# EAGLE board SDA391V1_TASLAK (EAGLE 9.6.2), part 1 of 2
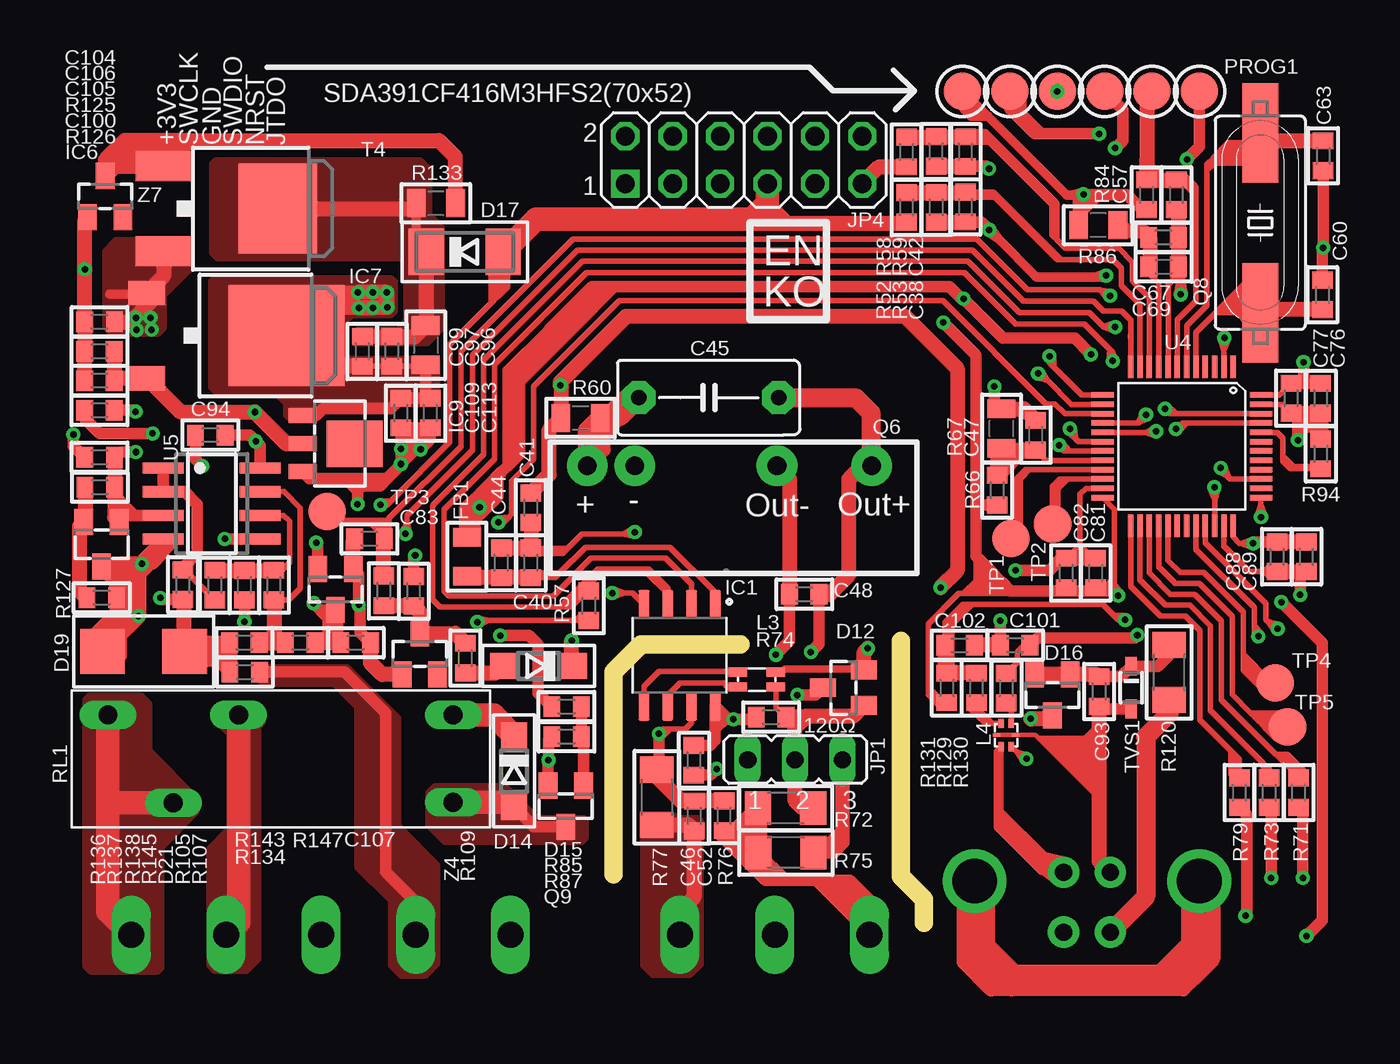
[diagram p5: board, top side]
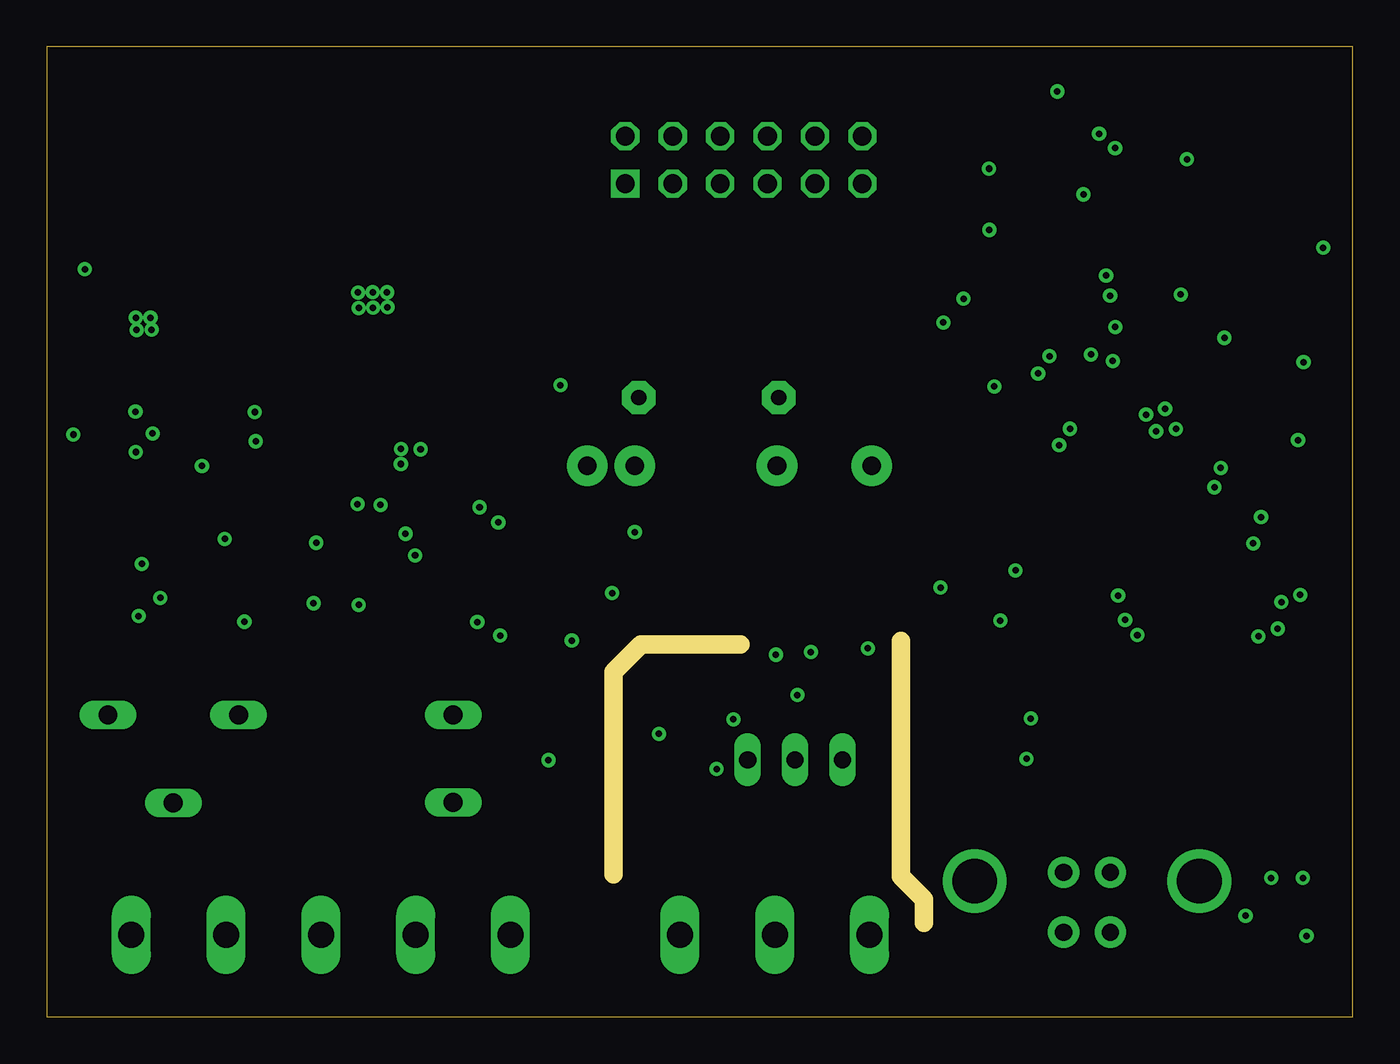
[diagram p6: board, inner layer Route3]
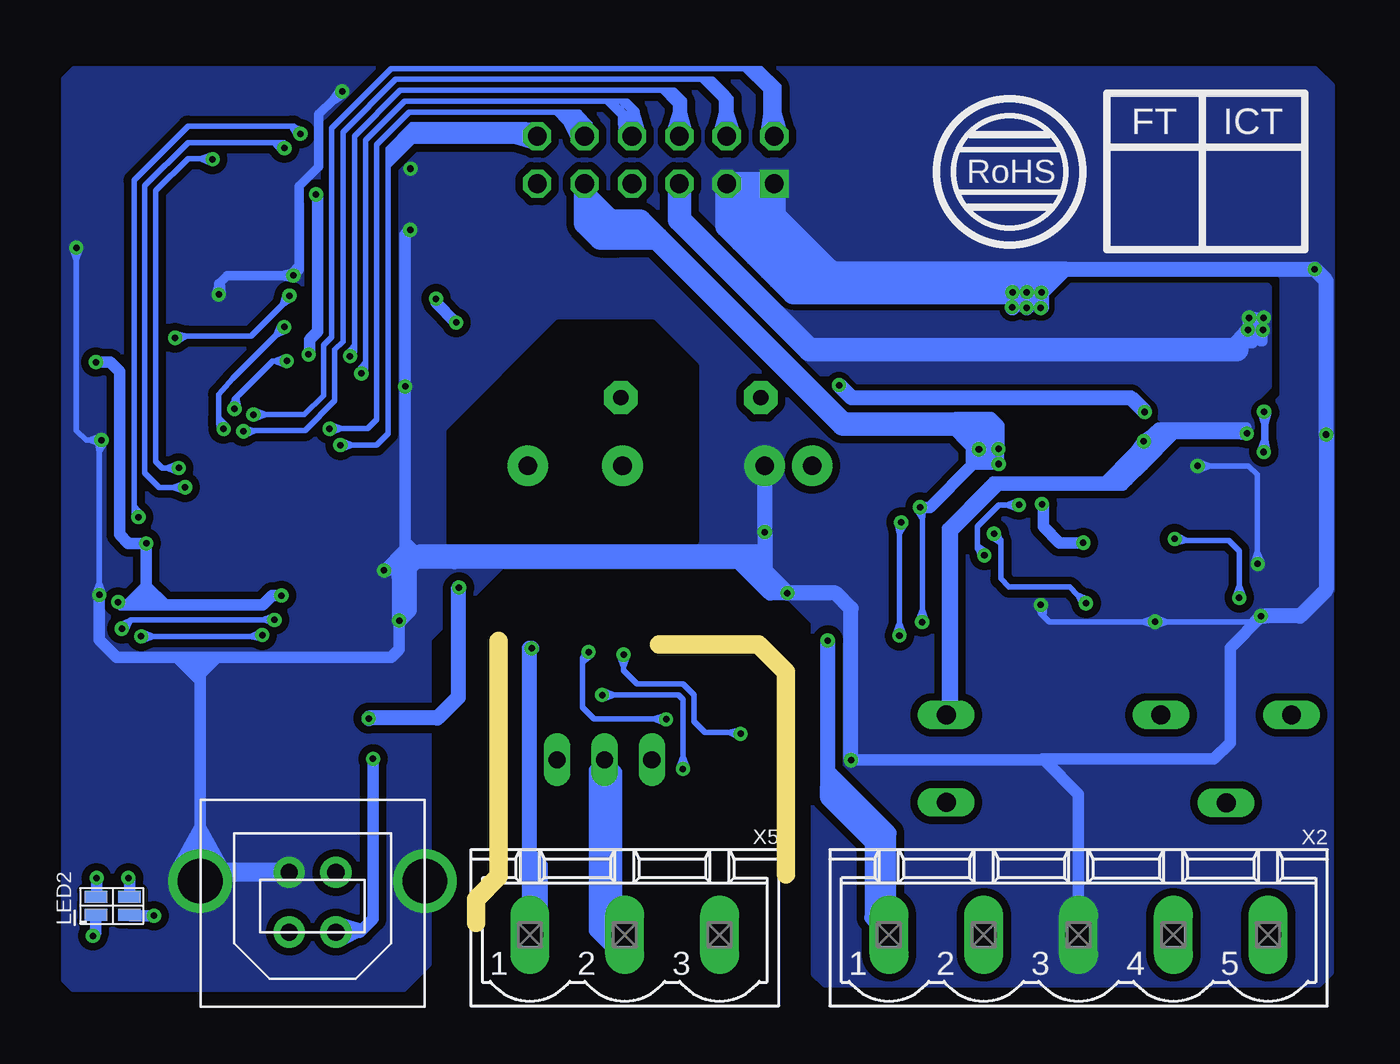
[diagram p7: board, bottom side, seen from below]

No outline drawn. Coordinates in mm, seen from the top.
Copper layers (1*3*16): Top 0.035mm / dielectric 1.53mm / Route3 0mil / dielectric 0mil / Bottom 0.035mm
Design rules "default *": minimum track width 6mil, minimum drill 0.35mm, track to track 11mil, track to pad 11mil, pad to pad 11mil, via to via 11mil, smd to smd 11mil, copper to edge 40mil, drill to drill 6mil, minimum pad ring 10mil, minimum via ring 8mil, stop-mask expansion 4mil, vias tented up to drill 0mil, thermal gap 10mil
Milling: 6 lines

## Footprints (pad centres in the part's own frame; a part is rotated, then mirrored left to right if it is on the bottom)
C0603_ENKO = smd 0.9 x 1.1: 1 -0.794,0; 2 0.794,0
C050-055X075_SMALL = drill 0.813 pad 1.778 octagon: 1 -3.75,0; 2 3.75,0
C0805_ENKO = smd 1 x 1.5: 1 -1.052,0; 2 1.052,0
SOT23 = smd 1 x 1.4: 1 -0.95,-1.1; 2 0.95,-1.1; 3 0,1.1
SOD123 = smd 1.4 x 1.4: A 1.9,0; C -1.9,0
M7_DC_DIYOT = smd 1.9 x 2.5: A -2.05,0; C 2.05,0
TRANSIL_SMB = smd 2.4 x 2.4: A 2.2,0; A1 -2.2,0
FERRITE_BEAT_0805 = smd 1 x 1.5: 1 -1.052,0; 2 1.052,0
ISO1044 = smd 1.55 x 0.59: 1 -2.725,1.905; 2 -2.725,0.635; 3 -2.725,-0.635; 4 -2.725,-1.905; 5 2.725,-1.905; 6 2.725,-0.635; 7 2.725,0.635; 8 2.725,1.905
TL431_SOT23F = smd 1 x 1.4: A 0,1.2; C -0.95,-1.2; R 0.95,-1.2
TO252 = smd 1.3 x 2: 1 -2.28,-5; 2 2.28,-5 | smd 5.4 x 6.2: 3 0,2.5
SOT89 = smd 0.8 x 1.5: 1 -1.5,-1.75; 2 0,-1.75; 3 1.5,-1.75 | smd 2.5 x 3: 4 0,1.05
JP2 = drill 0.914 long: 1 -2.54,0; 2 0,0; 3 2.54,0
2X06 = drill 1 square: 1 -6.35,-1.27 | drill 1 octagon: 2 -6.35,1.27; 3 -3.81,-1.27; 4 -3.81,1.27; 5 -1.27,-1.27; 6 -1.27,1.27; 7 1.27,-1.27; 8 1.27,1.27; 9 3.81,-1.27; 10 3.81,1.27; 11 6.35,-1.27; 12 6.35,1.27
ACM2012-900--2P-T002 = smd 1 x 0.5: 1 -1.02,0.4; 2 -1.02,-0.4; 3 1.02,-0.4; 4 1.02,0.4
EXC24CS_COMMON_MODE = smd 0.4 x 0.2: 1 -0.5,0; 4 0.5,0 | smd 0.3 x 0.5: 2 -0.275,-0.625; 3 0.275,-0.625; 5 0.275,0.625; 6 -0.275,0.625
CCS3210_RGB_LED = smd 1.2 x 0.65: 1 -0.9,0.475; 2 0.9,0.475; 3 0.9,-0.475; 4 -0.9,-0.475
PROG_6PIN = smd 2 x 2: 1 0,6.35; 2 0,3.81; 3 0,1.27; 4 0,-1.27; 5 0,-3.81; 6 0,-6.35
RFMM-0505S = drill 1 pad 2.184: 1 -7.825,2.255; 2 -5.285,2.255; 5 2.335,2.255; 7 7.415,2.255
HC49UP = smd 5.334 x 1.93: 1 -4.826,0; 2 4.826,0
R0603_ENKO = smd 0.9 x 1.1: 1 -0.794,0; 2 0.794,0
R0805_ENKO = smd 1 x 1.5: 1 -1.052,0; 2 1.052,0
R1206_ENKO = smd 1.4 x 1.8: 1 -1.479,0; 2 1.479,0
ALD1_AND_ALJ_RELAY = drill 1.016 pad 1.27 long: 1 -8.997,-2.129; 2 -8.998,2.565; P0 9.505,-2.132; P1 6.007,2.571; S0 2.507,-2.129
DPAK = smd 1.6 x 3: 1 -2.28,-4.04; 3 2.28,-4.04 | smd 4.826 x 4.191: 4 0,2.096
TP20R = smd 2 x 2: TP 0,0
SOD323 = smd 1 x 0.6: A 1.143,0; C -1.143,0
STM32F072CXXX_LQFP48 = smd 0.3 x 1.2: 1 -2.75,-4.25; 2 -2.25,-4.25; 3 -1.75,-4.25; 4 -1.25,-4.25; 5 -0.75,-4.25; 6 -0.25,-4.25; 7 0.25,-4.25; 8 0.75,-4.25; 9 1.25,-4.25; 10 1.75,-4.25; 11 2.25,-4.25; 12 2.75,-4.25; 25 2.75,4.25; 26 2.25,4.25; 27 1.75,4.25; 28 1.25,4.25; 29 0.75,4.25; 30 0.25,4.25; 31 -0.25,4.25; 32 -0.75,4.25; 33 -1.25,4.25; 34 -1.75,4.25; 35 -2.25,4.25; 36 -2.75,4.25 | smd 1.2 x 0.3: 13 4.25,-2.75; 14 4.25,-2.25; 15 4.25,-1.75; 16 4.25,-1.25; 17 4.25,-0.75; 18 4.25,-0.25; 19 4.25,0.25; 20 4.25,0.75; 21 4.25,1.25; 22 4.25,1.75; 23 4.25,2.25; 24 4.25,2.75; 37 -4.25,2.75; 38 -4.25,2.25; 39 -4.25,1.75; 40 -4.25,1.25; 41 -4.25,0.75; 42 -4.25,0.25; 43 -4.25,-0.25; 44 -4.25,-0.75; 45 -4.25,-1.25; 46 -4.25,-1.75; 47 -4.25,-2.25; 48 -4.25,-2.75
SO08 = smd 0.6 x 2.2: 1 -1.905,-2.6; 2 -0.635,-2.6; 3 0.635,-2.6; 4 1.905,-2.6; 5 1.905,2.6; 6 0.635,2.6; 7 -0.635,2.6; 8 -1.905,2.6
MSTBV5 = drill 1.397 long: 1 -10.16,0; 2 -5.08,0; 3 0,0; 4 5.08,0; 5 10.16,0
MSTBV3 = drill 1.397 long: 1 -5.08,0; 2 0,0; 3 5.08,0
USB-BV = drill 0.914 pad 1.676: D+ -1.25,-1.7; D- -1.25,1.5; GND 1.25,-1.7; VBUS 1.25,1.5 | drill 2.4: P$2 -6.02,-1.24; P$3 6.02,-1.24

## Placement (x,y rotation side)
C38  1200920268**CAP 0603 CER 100nF 50V %10 X7R  [C0603_ENKO]  -20.76,43.4 270 top
C40  1200920253**CAP 0603 CER 10n 50V%10 X7R  [C0603_ENKO]  -44.06,24.33 270 top
C41  1019-3362**CAP 0603 CER 2.2uF 10V %10 X5R  [C0603_ENKO]  -44.05,27.29 270 top
C42  1200920268**CAP 0603 CER 100nF 50V %10 X7R  [C0603_ENKO]  -20.76,46.37 270 top
C44  1200920268**CAP 0603 CER 100nF 50V %10 X7R  [C0603_ENKO]  -45.64,24.33 270 top
C45  0019-3020**CAP TH CER 470pF 3kV Y5P %10 85C F=7.5 D=8.5  [C050-055X075_SMALL]  -34.52,33.19 0 top
C46  1200920268**CAP 0603 CER 100nF 50V %10 X7R  [C0603_ENKO]  -35.31,13.75 90 top
C47  1200920268**CAP 0603 CER 100nF 50V %10 X7R  [C0603_ENKO]  -17,31.18 90 top
C48  1019-3362**CAP 0603 CER 2.2uF 10V %10 X5R  [C0603_ENKO]  -29.4,22.65 180 top
C52  1200920253**CAP 0603 CER 10n 50V%10 X7R  [C0603_ENKO]  -35.29,10.77 90 top
C57  1200920268**CAP 0603 CER 100nF 50V %10 X7R  [C0603_ENKO]  -9.46,44.06 90 top
C60  1019-3352**CAP 0603 CER 22pF 50V %5 NPO  [C0603_ENKO]  -1.63,38.7 90 top
C63  1019-3352**CAP 0603 CER 22pF 50V %5 NPO  [C0603_ENKO]  -1.59,46.15 270 top
C67  1200920268**CAP 0603 CER 100nF 50V %10 X7R  [C0603_ENKO]  -10.15,41.78 0 top
C69  1019-3167**CAP 0603 CER 10nF 50V %10 X7R (AbC)  [C0603_ENKO]  -10.14,40.2 0 top
C76  1200920268**CAP 0603 CER 100nF 50V %10 X7R  [C0603_ENKO]  -1.72,33.16 270 top
C77  1019-3167**CAP 0603 CER 10nF 50V %10 X7R (AbC)  [C0603_ENKO]  -3.31,33.16 270 top
C81  1019-3167**CAP 0603 CER 10nF 50V %10 X7R (AbC)  [C0603_ENKO]  -13.79,23.79 90 top
C82  1200920268**CAP 0603 CER 100nF 50V %10 X7R  [C0603_ENKO]  -15.37,23.79 90 top
C83  1019-3167**CAP 0603 CER 10nF 50V %10 X7R (AbC)  [C0603_ENKO]  -52.7,25.62 180 top
C88  1019-3167**CAP 0603 CER 10nF 50V %10 X7R (AbC)  [C0603_ENKO]  -4.07,24.66 270 top
C89  1200920268**CAP 0603 CER 100nF 50V %10 X7R  [C0603_ENKO]  -2.49,24.66 270 top
C93  1200920268**CAP 0603 CER 100nF 50V %10 X7R  [C0603_ENKO]  -13.6,17.44 270 top
C94  1200920268**CAP 0603 CER 100nF 50V %10 X7R  [C0603_ENKO]  -61.23,31.18 180 top
C96  1019-3243**CAP 0805 CER 10uF 50V ±10% X5R -55°C ~ 85°C  [C0805_ENKO]  -49.68,36 270 top
C97  1200920640**CAP 0603 1UF 50V %10 X7R  [C0603_ENKO]  -51.5,35.66 270 top
C99  1200920640**CAP 0603 1UF 50V %10 X7R  [C0603_ENKO]  -53.08,35.66 270 top
C100  1200920268**CAP 0603 CER 100nF 50V %10 X7R  [C0603_ENKO]  -67.16,29.99 0 top
C101  1019-3381**CAP 0603 CER 33pf 50V %5 NPO(COG)  [C0603_ENKO]  -18.1,19.92 180 top
C102  1019-3381**CAP 0603 CER 33pf 50V %5 NPO(COG)  [C0603_ENKO]  -21.08,19.91 0 top
C104  1019-3366**CAP 0603 CER 10uF 16V %20 X5R  [C0603_ENKO]  -67.16,37.25 180 top
C105  1200920268**CAP 0603 CER 100nF 50V %10 X7R  [C0603_ENKO]  -67.17,34.1 180 top
C106  1200920640**CAP 0603 1UF 50V %10 X7R  [C0603_ENKO]  -67.17,35.67 180 top
C107  1200920268**CAP 0603 CER 100nF 50V %10 X7R  [C0603_ENKO]  -53.44,20.05 180 top
C109  1200920268**CAP 0603 CER 100nF 50V %10 X7R  [C0603_ENKO]  -51.02,32.36 90 top
C113  1019-3366**CAP 0603 CER 10uF 16V %20 X5R  [C0603_ENKO]  -49.44,32.36 90 top
D12  1119-3034**ESD Protection Diode for CANBUS NXP PESD2CAN SOT23  [SOT23]  -27.3,17.64 90 top
D14  1200980377**DIODE SWITCHING SMD 75V 200mA SOD-123 1N4148W  [SOD123]  -44.95,13.17 270 top
D15  1200980377**DIODE SWITCHING SMD 75V 200mA SOD-123 1N4148W  [SOD123]  -43.63,18.8 180 top
D16  1119-3027**DIODE 75V 200MA SOT23 BAS16 (AbC)  [SOT23]  -16.1,17.25 180 top
D17  1200980468**DIODE RECTIFIER SMD 1000V 1A GS1M  [M7_DC_DIYOT]  -47.59,41 180 top
D19  1039-3023**DIODE TVS 600W 12V DO214AA BIPOLAR  [TRANSIL_SMB]  -64.81,19.59 0 top
D21  1200980593**DIODE SCHOTTKY BARRIER DOUBLE SMD 30V 200mA BAT54S  [SOT23]  -54.52,22.91 180 top
FB1  1319-4060**Ferrite Bead SMD 0805 2kOhm@100MHz 300mA LAIRD HZ0805C202R-10  [FERRITE_BEAT_0805]  -47.48,24.66 270 top
IC1  1039-2381**ISO1044 Isolated CAN FD Transceiver 8-SOIC(D)  [ISO1044]  -36.08,19.38 270 top
IC6  1200980448**IC REGULATOR VOLTAGE SMD ZTL431AFFTA 2.5V %1  [TL431_SOT23F]  -67.06,25.33 180 top
IC7  1200980254**IC REGULATOR VOLTAGE SMD 7805 +5V  [TO252]  -59.64,36.51 270 top
IC9  1039-3003**Voltage Regulator SOT-89 3.3V Diodes AP2204RA-3.3TRG1  [SOT89]  -54.54,30.72 270 top
JP1  0309-2108**PIN HEADER 1307-1x40-SY2-A (h:15mm) 180_DERECE  [JP2]  -29.89,13.78 0 top
JP4  [2X06]  -32.64,45.93 0 top
L3  1319-4002**ACM2012 SMD Common Mode Filter  [ACM2012-900--2P-T002]  -31.94,18.08 0 top
L4  1319-4100**EXC24 Common Mode Noise Filters with ESD Suppressor(0504 Size)  [EXC24CS_COMMON_MODE]  -18.58,15.1 0 top
LED2  1209-0010**LED SMD 1616 RGB Lite-On LTST-C19HE1WT  [CCS3210_RGB_LED]  -3.54,5.95 0 bottom
PCB1  0369-5027**PCB [ARGE?] SDA391CF416M3HFS2(70x52)  [PCB]  -43.18,401.32 0 top
PROG1  NC**TAKILMAYACAK  [PROG_6PIN]  -14.57,49.6 90 top
Q6  1039-2335**DC-DC Converter 5V to 5V 1W RFMM-0505S  [RFMM-0505S]  -33.2,27.28 0 top
Q8  1149-0006**HC49S SMD KRISTAL 8MHZ -40+85 20PF 50PPM FAT Y3MM  [HC49UP]  -4.96,42.56 90 top
Q9  1200980090**TRANS SMD NPN BC847B SOT-23  [SOT23]  -42.18,11.29 180 top
R52  1200970803**RES 0603 100K %1 1/10W  [R0603_ENKO]  -23.92,43.38 90 top
R53  1200971020**RES 0603 10K %1 1/10W  [R0603_ENKO]  -22.33,43.39 270 top
R57  1200970518**RES 0603 10K %5 1/10W  [R0603_ENKO]  -40.94,22.04 270 top
R58  1200970803**RES 0603 100K %1 1/10W  [R0603_ENKO]  -23.92,46.35 90 top
R59  1200970770**RES 0603 4K3 %1 1/10W  [R0603_ENKO]  -22.34,46.38 270 top
R60  1319-4025**INDUCTOR SMD 0805 4.7uH 500mA CL2012C-4R7M Core Master  [R0805_ENKO]  -41.39,32.1 0 top
R66  1200970583**RES 0603 1K %1 1/10W  [R0603_ENKO]  -19.06,28.23 270 top
R67  1169-1001**TSM2A103F3951RZ THINKING 0805 10K NTC 125C  [R0805_ENKO]  -18.83,31.53 90 top
R71  1029-2005**RES 0603 220R %1  [R0603_ENKO]  -2.91,12.02 270 top
R72  NC**TAKILMAYACAK  [R1206_ENKO]  -30.4,11.18 0 top
R73  1029-2005**RES 0603 220R %1  [R0603_ENKO]  -4.49,12.02 270 top
R74  1200970519**RES 0603 4K7 %5 1/10W  [R0603_ENKO]  -31.18,16.06 180 top
R75  1029-3164**RES 1206 120R %1  [R1206_ENKO]  -30.39,8.8 0 top
R76  1200970519**RES 0603 4K7 %5 1/10W  [R0603_ENKO]  -33.7,10.78 270 top
R77  1200970601**RES 1206 10R %5 1/4W  [R1206_ENKO]  -37.3,11.77 90 top
R79  1029-2005**RES 0603 220R %1  [R0603_ENKO]  -6.08,12.02 270 top
R84  1200970518**RES 0603 10K %5 1/10W  [R0603_ENKO]  -11.05,44.06 90 top
R85  1200970522**RES 0603 1K %5 1/10W  [R0603_ENKO]  -42.14,16.63 180 top
R86  1319-4060**Ferrite Bead SMD 0805 2kOhm@100MHz 300mA LAIRD HZ0805C202R-10  [R0805_ENKO]  -13.65,42.43 180 top
R87  1200970518**RES 0603 10K %5 1/10W  [R0603_ENKO]  -42.14,15.02 0 top
R94  1200970522**RES 0603 1K %5 1/10W  [R0603_ENKO]  -1.72,30.17 270 top
R105  1200970518**RES 0603 10K %5 1/10W  [R0603_ENKO]  -51.93,22.83 270 top
R107  1200970568**RES 0603 47K %5 1/10W  [R0603_ENKO]  -50.33,22.81 270 top
R109  1409-0025**RES 0603 470R %5 1/16W  [R0603_ENKO]  -47.56,19.23 90 top
R120  1169-1006**FUSE SMD 1206 PTC RESETTABLE 16V IHOLD=0.75A IMAX=100A  [R1206_ENKO]  -9.84,18.46 270 top
R125  1029-2234**RES 0603 4K7 %1  [R0603_ENKO]  -67.17,32.51 180 top
R126  1200970583**RES 0603 1K %1 1/10W  [R0603_ENKO]  -67.15,28.39 0 top
R127  1029-2231**RES 0603 1K8 %1  [R0603_ENKO]  -67.05,22.46 180 top
R129  1029-6086**RES 0603 22R %1  [R0603_ENKO]  -20.17,17.63 90 top
R130  1029-6086**RES 0603 22R %1  [R0603_ENKO]  -18.57,17.62 90 top
R131  1200970852**RES 0603 1K5 %5 1/10W  [R0603_ENKO]  -21.76,17.63 270 top
R133  1200970121**RES 0805 1K %5 1/8W  [R0805_ENKO]  -49.14,43.6 180 top
R134  1029-6086**RES 0603 22R %1  [R0603_ENKO]  -59.38,18.48 180 top
R136  1029-2234**RES 0603 4K7 %1  [R0603_ENKO]  -62.69,23.16 90 top
R137  1200970684**RES 0603 47K %1 1/10W  [R0603_ENKO]  -60.98,23.14 270 top
R138  1200970583**RES 0603 1K %1 1/10W  [R0603_ENKO]  -59.4,23.13 90 top
R143  1029-2229**RES 0603 120K %1  [R0603_ENKO]  -59.4,20.05 0 top
R145  1029-2219**RES 0603 30K %1  [R0603_ENKO]  -57.82,23.14 270 top
R147  1200970730**RES 0603 560R %1 1/10W  [R0603_ENKO]  -56.41,20.06 0 top
RL1  1200930051**RELAY SPST 12V 5A 7x15x20.3mm  [ALD1_AND_ALJ_RELAY]  -57.21,14.05 180 top
T4  1109-1016**Transistor NPN 3A 100V 15W Hfemin:10 DPAK Diodes MJD31C-13  [DPAK]  -59.7,43.32 270 top
TP1  PTR1TP20R  [TP20R]  -18.32,25.63 0 top
TP2  PTR1TP20R  [TP20R]  -16.09,26.41 0 top
TP3  PTR1TP20R  [TP20R]  -54.96,27.08 0 top
TP4  PTR1TP20R  [TP20R]  -4.16,17.9 0 top
TP5  PTR1TP20R  [TP20R]  -3.5,15.55 0 top
TVS1  1119-3061**5V 130W TVS Diode SOD-323  [SOD323]  -11.88,17.65 270 top
U4  1039-2220**STM32F072C8T6 64K Flash USB, CAN  [STM32F072CXXX_LQFP48]  -9.16,30.58 180 top
U5  1039-2009**OPAMP 3-32 V Dual 70C SO8 LM358  [SO08]  -61.15,27.51 270 top
U$1  [EN-KO_AMLEMI]  -30.22,39.86 0 top
U$2  [ROHS]  -51.61,45.29 0 bottom
U$3  [FT-ICT]  -61.93,45.41 0 bottom
X2  0289-1466**MSTBVA 2.5/5-G-5.08 (Phoenix 1755765)  [MSTBV5]  -55.3,4.4 0 bottom
X2K  0289-1467**MVSTBW 2.5/5-ST-5.08 (Phoenix 1792786)  [SOKET]  -50.8,401.32 0 top
X5  0289-1207**MSTBVA 2.5/3-G-5.08 (Phoenix 1755749)  [MSTBV3]  -30.98,4.4 0 bottom
X5K  0289-9156**MVSTBW 2.5/3-ST-5.08 (Phoenix 1792760)  [SOKET]  -46.99,401.32 0 top
X7  0309-1065**USB Type-B Mini Connector Vertical  [USB-BV]  -14.25,6.04 180 bottom
XK4  0309-2055**MJ-03-01-A1 MINIJUMPER(1308-2P)  [SOKET]  -39.37,401.32 0 top
Z4  1129-1162**ZENER SOT23 3V9 300mW BZX84C3V9  [SOT23]  -50,19.45 0 top
Z7  1129-1160**ZENER SOT23 12V 300mW BZX84C12V (AbC)  [SOT23]  -66.86,43.97 0 top

## Tracks (layer width: path | path; a pad name or v marks a point on that pad's centre or on a via)
5.CANL
  Top 0.305: IC1.5 -37.98,17.71 -37.19,18.51 -32.99,18.51 L3.1
30V_  (via drill 0.35)
  Top 0.305: v-52.11,27.43 -51.76,27.43 -51.52,27.68 | -51.52,27.68 -48.4,30.8 -48.4,36.02 -46.17,38.24 | D17.A -45.54,38.88 | -45.75,38.67 -45.54,38.88 | -45.75,38.67 -46.01,38.4 | -46.01,38.4 -46.17,38.24 | -45.75,38.67 -45.75,40.18 -45.98,40.41 | -45.98,40.41 -46.16,40.59 | -46.01,38.4 -46.01,40.12 | -46.01,40.12 -46.01,40.38 -45.98,40.41 | -46.17,38.24 -46.17,39.96 -46.01,40.12 | -45.54,38.88 -45.29,39.12 -45.29,40.37 | -51.52,27.68 -52.12,27.66 v-52.11,27.43 | -51.52,27.68 -51.96,27.27 v-52.11,27.43
  Top 0.61: R107.1 -50.33,24.66 v-50.26,24.73
  Top 0.813: R52.1 -23.98,42.53 -30.29,42.53 | -30.29,42.53 -30.7,42.53 | -30.7,42.53 -33.09,42.53 | -30.7,42.53 -31.37,43.2 -31.37,43.61 -30.29,42.53
  Top 1.27: D17.A -43.78,42.76 -32.23,42.76 -31.37,43.61 JP4.7
  Bottom 0.305: -51.47,27.43 -51.04,27.43 -49.89,26.28 -49.89,25.26 | -51.47,27.43 v-52.11,27.43 | v-50.26,24.73 -49.89,25.1 -49.89,25.26 | -49.89,25.26 -50.38,24.92 v-50.26,24.73 | -49.89,25.26 -50.04,24.68 v-50.26,24.73 | -51.47,27.43 -52.03,27.64 v-52.11,27.43 | -51.47,27.43 -52.03,27.22 v-52.11,27.43
+3V3_  (via drill 0.35)
  Top 0.305: D21.2 -55.5,24.04 | -41.08,21.39 R57.2 -41.63,21.25 | FB1.1 -47.53,25.66 -47.53,25.57 -47.59,25.63 | v-46.92,21.16 -46.84,21.25 -46.28,21.25 | -46.28,21.25 -41.63,21.25 | R131.2 -21.92,16.84 -22.76,17.68 | -22.76,17.68 -22.76,21.07 -21.14,22.69 -20.89,22.69 | -20.89,22.69 -20.52,22.69 | -20.52,22.69 -20.21,22.69 | -20.21,22.69 -19.93,22.69 | -19.93,22.69 -19.78,22.69 | -19.78,22.69 -19.61,22.69 | -19.61,22.69 -19.33,22.69 | -19.33,22.69 -18.92,22.69 | -18.92,22.69 -18.49,22.69 -18.35,22.84 | U4.36 -6.41,25.71 -6.08,25.38 -5.98,25.38 | -5.98,25.38 v-5.34,25.38 | -4.14,25.38 C88.1 | U4.48 -3.93,33.33 C77.1 C76.1 | C82.1 -15.26,22.89 -15.26,22.84 | -13.94,22.84 -13.79,22.99 C81.1 -13.33,23 -13.04,23.28 | U4.24 -12.78,27.2 -12.78,23.54 | -13.04,23.28 -12.78,23.54 | -20.21,27.44 | R84.1 -11.29,43.27 | -12.78,23.54 -12.78,23.19 | -12.78,23.19 -12.78,23.02 | -12.84,22.84 -12.78,22.89 -12.78,23.02 | -13.04,23.28 -12.9,23.14 | -12.9,23.14 -12.78,23.02 | -18.8,23.3 -18.92,23.18 -18.92,22.69 | -18.99,23.48 -18.99,23.03 -19.23,22.79 | -19.33,22.69 -19.23,22.79 | -19.23,22.79 -19.23,23.07 | -19.23,23.07 -19.23,23.73 -19.41,23.55 -19.41,22.89 | -19.23,23.07 -19.41,22.89 | -19.41,22.89 -19.61,22.69 | -19.52,24 -19.52,22.95 -19.78,22.69 | -19.66,24.16 -19.66,22.95 -19.93,22.69 | -19.86,24.34 -19.86,23.05 -20.21,22.69 | -20.02,24.51 -20.02,23.19 | -20.02,23.19 -20.52,22.69 | -20.21,24.7 -20.21,23.38 | -20.02,23.19 -20.21,23.38 | -20.21,23.38 -20.21,23.37 -20.89,22.69 | -22.76,17.68 -22.76,17.53 | -21.98,16.75 -22.76,17.53 | -22.76,17.53 -22.76,17.25 -22.09,16.58 | -41.63,21.25 -41.36,21.52 -41.36,21.53 | -12.78,23.19 -12.81,22.59 v-12.58,22.58
  Top 0.305: -12.78,23.19 -12.4,22.72 v-12.58,22.58 | -12.9,23.14 -12.8,22.54 v-12.58,22.58 | -12.9,23.14 -12.44,22.75 v-12.58,22.58 | -46.28,21.25 -46.87,21.38 v-46.92,21.16 | -46.28,21.25 -46.81,20.96 v-46.92,21.16 | -5.98,25.38 -5.42,25.17 v-5.34,25.38 | -5.98,25.38 -5.42,25.59 v-5.34,25.38
  Top 0.508: PROG1.1 -20.87,49.6 -19.55,48.28 | -19.55,48.28 -15.32,44.05 -15.08,44.05 | v-14.44,44.08 -14.47,44.05 -15.08,44.05 | -44.92,29.91 -44.92,34.52 | -42.63,36.81 -42.35,36.81 -41.96,36.81 | -42.63,36.81 -44.92,34.52 | -45.16,29.66 -45.16,34.27 | -45.16,34.27 -44.92,34.52 | -45.36,29.47 -45.36,29.56 -45.31,29.61 -45.31,34.13 | -45.31,34.13 -45.16,34.27 | -45.31,34.13 -45.31,34.66 -43.16,36.81 -43.1,36.81 -42.63,36.81 | -19.55,48.28 -20.07,48.28 | -20.94,49.16 -20.07,48.28 | -20.07,48.28 -20.46,48.28 -21.25,49.07 | -15.08,44.05 -14.46,43.96 v-14.44,44.08 | -15.08,44.05 -14.47,44.2 v-14.44,44.08
  Top 0.61: IC9.3 -55.92,28.85 -53.98,28.85 | v-51.01,30.44 -51.01,29.59 -51.75,28.85 | v-51.01,30.44 -51.01,31.56 C109.1 -49.88,31.57 | -53.98,28.85 -53.34,28.85 | -53.34,28.85 -52.7,28.85 | -49.88,31.57 C113.1 -49.44,30.94 v-49.96,30.42 | v-53.34,27.48 -53.34,28.21 | -53.34,28.85 -53.34,28.21 | -46.32,28.51 -46.8,28.03 | -45.62,29.21 -45.36,29.47 -45.16,29.66 -44.92,29.91 -44.67,30.16 -44.67,34.05 -41.66,37.06 | -46.8,28.03 v-46.8,27.31 -46.8,26.89 | -41.66,37.06 -41.13,37.59 | -41.13,37.59 -40.89,37.83 | -40.89,37.83 -40.5,38.23 | -39.58,39.14 -40.5,38.23 | -39.58,39.14 -21.62,39.14 -20.92,38.44 v-20.87,38.49 -18.75,36.38 -14.91,36.38 v-14.03,35.5 | v-21.95,37.22 -20.21,35.48 -20.21,27.44 | -20.21,27.44 -20.21,24.7 -20.02,24.51 -19.86,24.34 -19.66,24.16 -19.52,24 -19.23,23.73 -18.99,23.48 -18.8,23.3 -18.35,22.84 -15.26,22.84 -13.94,22.84 -12.84,22.84 v-12.58,22.58 | -53.34,28.21 -53.09,28.46 | -53.09,28.46 -52.7,28.85 | -52.7,28.85 -51.75,28.85 | -53.34,28.21 -53.98,28.85 | -53.09,28.46 -52.14,28.46 -51.75,28.85 | v-51.02,29.63 -50.23,30.42 v-49.96,30.42 | v-51.01,30.44 -49.98,31.46 | -49.98,31.46 -49.88,31.57 | v-49.96,30.42 -49.98,30.45 -49.98,31.46 | v-2.64,35.09 -2.64,33.98 -2.61,33.95 C76.1 | FB1.1 -47.35,25.84 | -47.35,25.84 -47.16,26.03 | -47.16,26.03 -47.05,26.14 -47.05,26.64 -46.8,26.89 | D21.2 -55.47,25.33 v-55.55,25.41 | v-2.48,4.34 -1.64,5.18 -1.64,20.04 v-3.83,22.23 | C88.1 -5.27,25.45 v-5.34,25.38 | -20.21,27.44 R66.2 | R84.1 -11.29,43.27 -12.1,44.08 -13.63,44.08 | -13.63,44.08 v-14.44,44.08 -14.7,43.81 R86.2 -14.7,43.01 -13.63,44.08 | -43.1,36.81 -42.13,37.77 | -42.13,37.77 -41.74,38.16
  Top 0.61: -41.74,38.16 -41.34,38.56 | -41.34,38.56 -40.9,39.02 | -40.9,39.02 -40.77,39.14 -39.58,39.14 | -42.35,36.81 -42.1,37.06 -41.83,37.06 | -41.83,37.06 -41.66,37.06 | -42.13,37.77 -41.83,37.47 -41.83,37.06 | -41.13,37.59 -41.17,37.59 -41.74,38.16 | -40.89,37.83 -40.89,38.11 -41.34,38.56 | -40.9,39.02 -40.62,38.74 -40.62,38.35 -40.5,38.23 | -46.8,26.89 -46.32,27.37 | -46.32,27.37 -46.32,27.91 | -46.32,27.91 -46.32,28.51 | -46.32,28.51 -45.62,29.21 | -46.32,27.91 -45.81,28.42 | -45.81,28.42 -45.81,29.01 -45.62,29.21 | -46.32,27.37 -45.81,27.88 -45.81,28.42 | -46.8,28.03 -47.16,27.67 | -47.16,27.67 -47.16,26.03 | -47.16,27.67 -47.35,27.48 | -47.35,27.48 -47.35,25.84 | -47.35,27.48 -47.59,27.24 -47.59,25.63
  Top 0.813: C89.1 C88.1
  Bottom 0.305: v-46.8,27.31 -46.92,27.19 -46.92,26.68 | -46.92,26.68 -46.92,21.81 | -46.92,21.81 v-46.92,21.16 | -5.34,22.21 -5.2,22.07 | -46.92,26.68 -46.61,27.19 v-46.8,27.31 | -46.92,26.68 -47.02,27.27 v-46.8,27.31 | -46.92,21.81 -47.13,21.24 v-46.92,21.16 | -46.92,21.81 -46.71,21.24 v-46.92,21.16
  Bottom 0.508: -30.67,41.74 -28.86,43.55 -28.86,44.37 | -31.09,41.74 -30.17,42.66 -30,42.84
  Bottom 0.61: -4.34,22.07 -3.99,22.07 v-3.83,22.23 | -4.34,22.07 -5.2,22.07 -6.34,22.07 | -6.34,22.07 -11.58,22.07 -12.09,22.58 v-12.58,22.58 | v-55.55,25.41 -54.28,25.41 -53.42,26.27 -53.42,27.4 v-53.34,27.48 | v-46.8,27.31 -47.33,27.31 -49.57,29.55 | -49.65,29.63 -50.05,30.03 | -50.05,30.03 -50.46,30.03 -50.46,30.44 | -50.46,30.44 v-51.01,30.44 | v-51.01,30.44 v-51.02,30.44 | v-20.87,38.49 -20.87,38.27 -21.93,37.22 v-21.95,37.22 | v-51.01,30.44 -51.01,30.58 | -51.02,30.91 -51.02,30.57 -51.01,30.58 | -51.02,30.91 -51.02,31.32 | -51.02,31.32 -51.02,31.7 -50.61,32.11 -48.73,32.11 | -51.02,31.32 -50.56,31.78 -50.15,31.78 | -51.02,30.91 -50.15,31.78 | -50.15,31.78 -49.81,31.78 | -49.57,31.78 -49.27,31.78 | -51.01,30.58 -50.46,31.13 | -50.46,31.13 -50.05,31.55 | -49.81,31.78 -49.57,31.78 | -50.46,30.44 -50.46,31.13 | -50.05,31.55 -50.05,30.03 | -50.05,31.55 -49.81,31.78 | -50.05,30.03 -49.57,30.5 | -49.57,31.78 -49.57,30.55 | -49.57,30.5 -49.57,30.55 | -48.34,31.78 -49.57,30.55 | -49.57,30.5 -49.57,29.55 | v-51.01,30.44 v-51.01,29.64 v-51.02,29.63 -49.65,29.63 | -49.65,29.63 -49.57,29.55 | -5.34,23.07 v-5.34,25.38 -4.38,25.38 -3.91,25.85 -3.91,34.58 -3.4,35.09 v-2.64,35.09 | -5.34,22.21 -5.34,23.07 | v-14.03,35.5 -14.11,35.58 -14.11,36.31 -14.53,36.73 -14.53,43.99 v-14.44,44.08 | LED2.4 -2.64,4.5 v-2.48,4.34 | -5.34,23.07 -6.34,22.07 | -5.34,23.07 -4.34,22.07
  Bottom 1.27: -32.71,41.74 -31.09,41.74 -30.67,41.74 -29.69,41.74 -28.88,42.55 -28.88,43.95 | -32.71,41.74 -42.67,31.78 -48.34,31.78 -49.27,31.78 | -28.88,43.95 -28.88,44.61 JP4.9 | -32.71,41.74 -31.79,42.66 -30.17,42.66 | -30,42.84 -28.88,43.95
+5V  (via drill 0.35)
  Top 0.61: C41.1 -43.88,28.08
  Top 0.813: C106.1 C105.1 -66.25,34.23 IC7.2 -62.83,32.42 v-58.85,32.42 -57.16,30.72 IC9.2 | v-22.1,23.01 -21.2,23.91 -21.2,34.75 -23.99,37.54 -38.96,37.54 -42.46,34.03 v-42.46,33.85 -42.44,33.83 R60.1 -43.07,31.47 -43.07,29.06 C41.1 | v-17.26,15.99 -17.23,15.96 -16.29,15.96 D16.3
  Bottom 0.813: v-42.46,33.85 -43.13,33.19 -58.1,33.19 -58.85,32.44 v-58.85,32.42 | v-22.1,23.01 -22.05,22.96 -22.05,17.12 -20.94,16.01 -17.26,16.01 v-17.26,15.99
+12V_  (via drill 0.35)
  Top 0.508: IC7.1 -64.7,38.73 -66.62,38.73 -66.63,38.74
  Top 0.61: R125.2 -67.96,32.08 -67.15,31.27 v-64.32,31.27 | C94.1 -59.12,31.18 v-58.79,30.85 -58.55,30.61 U5.8
  Top 0.813: C104.1 -65.5,37.25 -64.5,38.25 IC7.1 -63.74,39.69 T4.3
  Top 1.27: RL1.1 -46.06,16.18 D14.C
  Bottom 0.305: -58.84,30.85 v-58.79,30.85
  Bottom 0.508: -64.18,31.21 -63.68,31.21 | -63.68,31.21 -60.47,31.21 | -60.28,31.22 -60.48,31.22 -60.47,31.21 | -60.28,31.22 -59.75,31.22 | -59.75,31.22 -59.32,31.22 | -59.32,31.22 -59.16,31.22 | -59.16,31.22 v-58.79,30.85 | -56.51,28.44 -51.05,28.44 -48.59,25.98 -48.59,16.56 RL1.1 -48.21,26.21 -50.45,28.45 | -56.51,28.44 -57.7,28.44 -57.98,28.72 -57.48,28.72 | v-58.79,30.85 -58.79,30.26 | -58.79,30.26 -58.79,30.21 | -58.79,30.21 -58.79,30.03 | -58.79,30.03 -58.79,29.73 | -57.99,28.73 -58.79,29.53 | -63.6,35.39 -63.6,35.59 -63.78,35.77 | -64.04,35.51 -63.78,35.77 | -64.08,36.08 -64.19,36.18 -64.74,36.18 -64.67,36.25 | -64.08,36.08 -63.78,35.77 | -65.05,36.18 -65.18,36.18 v-65.18,36.81 | -65.05,36.18 -65.04,36.18 | -64.84,36.27 -64.98,36.41 -64.87,36.41 | -64.84,36.27 -64.64,36.08 -64.08,36.08 | -65.09,36.83 -65.02,36.83 | -65.02,36.83 -64.54,36.83 | -64.54,36.83 -64.5,36.83 | -64.5,36.83 v-64.38,36.83 | v-64.38,36.83 | v-64.38,36.83 -64.23,36.83 -64.11,36.7 | -64.11,36.7 -63.86,36.46 | -63.86,36.46 -63.17,35.77 | -64.67,36.25 -64.22,36.7 -64.11,36.7 | v-64.38,36.83 | v-64.38,36.83 -64.56,36.65 | -64.56,36.65 -64.8,36.41 -64.87,36.41 | v-64.38,36.83 -64.44,36.89 v-64.44,37.47 | v-64.38,36.83 -64.68,37.13 | -64.68,37.13 -64.83,37.28 | -64.83,37.28 -65.02,37.47 -65.08,37.47 | -65.08,37.47 v-65.22,37.47 | -50.45,28.45 -51.08,28.45 | -57.48,28.72 -57.04,28.72 | -57.04,28.72 -50.72,28.72 -50.45,28.45 | -57.48,28.72 -58.53,29.76 | -58.53,29.76 -58.79,30.03 | -58.53,29.76 -58.53,30.2 | -58.53,30.2 -58.53,30.26 | -58.53,30.26 -58.53,30.59 | -58.53,30.59 v-58.79,30.85 | -64.33,31.62 -63.79,31.62 | -63.79,31.62 -59.56,31.62 -59.24,31.3 | -59.24,31.3 -59.16,31.22
  Bottom 0.508: -59.75,31.22 -59.43,30.9 | -59.43,30.9 -58.79,30.26 | -60.28,31.22 -58.79,29.73 | -58.79,29.73 -58.79,29.53 | -58.79,29.53 -60.47,31.21 | -58.53,30.2 -57.04,28.72 | -58.53,30.59 -58.34,30.39 | -58.34,30.39 -56.51,28.57 -56.51,28.44 | -63.68,31.21 -64.29,31.39 v-64.32,31.27 | -63.68,31.21 -64.31,31.14 v-64.32,31.27 | -63.79,31.62 -64.37,31.38 v-64.32,31.27 | -63.79,31.62 -64.24,31.18 v-64.32,31.27 | -59.32,31.22 -58.88,30.76 v-58.79,30.85 | -59.32,31.22 -58.74,30.96 v-58.79,30.85 | -58.79,30.21 -58.67,30.83 v-58.79,30.85 | -58.79,30.21 -58.91,30.83 v-58.79,30.85 | -58.53,30.26 -58.67,30.88 v-58.79,30.85 | -58.53,30.26 -58.89,30.78 v-58.79,30.85 | -59.24,31.3 -58.89,30.78 v-58.79,30.85 | -59.24,31.3 -58.72,30.95 v-58.79,30.85 | -59.43,30.9 -58.82,30.73 v-58.79,30.85 | -59.43,30.9 -58.8,30.97 v-58.79,30.85 | -58.34,30.39 -58.69,30.92 v-58.79,30.85 | -58.34,30.39 -58.86,30.75 v-58.79,30.85 | -64.68,37.13 -65.14,37.56 v-65.22,37.47 | -64.68,37.13 -65.27,37.35 v-65.22,37.47 | -65.05,36.18 -65.06,36.81 v-65.18,36.81 | -65.05,36.18 -65.3,36.76 v-65.18,36.81 | -64.84,36.27 -65.06,36.85 v-65.18,36.81 | -64.84,36.27 -65.27,36.73 v-65.18,36.81 | -64.54,36.83 -65.16,36.93 v-65.18,36.81 | -64.54,36.83 -65.15,36.69 v-65.18,36.81 | -64.56,36.65 -65.13,36.92 v-65.18,36.81 | -64.56,36.65 -65.19,36.69 v-65.18,36.81 | -64.5,36.83 -64.32,37.43 v-64.44,37.47 | -64.5,36.83 -64.56,37.46 v-64.44,37.47 | v-64.38,36.83 -64.32,37.46 | -64.32,37.46 v-64.44,37.47 | v-64.38,36.83 -64.56,37.43 v-64.44,37.47 | v-64.38,36.83 -64.32,37.46 | v-64.44,37.47 -64.32,37.46 | v-64.38,36.83 -64.56,37.44 v-64.44,37.47 | -65.08,37.47 -64.46,37.35 v-64.44,37.47
  Bottom 0.508: -65.08,37.47 -64.46,37.59 v-64.44,37.47 | -65.02,36.83 -64.4,36.71 v-64.38,36.83 | -65.02,36.83 -64.4,36.95 v-64.38,36.83 | -63.86,36.46 -64.29,36.91 v-64.38,36.83 | -63.86,36.46 -64.43,36.72 v-64.38,36.83 | -64.67,36.25 -64.28,36.75 v-64.38,36.83 | -64.67,36.25 -64.5,36.86 v-64.38,36.83 | -64.87,36.41 -64.32,36.72 v-64.38,36.83 | -64.87,36.41 -64.48,36.91 v-64.38,36.83 | -64.83,37.28 -64.48,36.76 v-64.38,36.83 | -64.83,37.28 -64.31,36.93 v-64.38,36.83
  Bottom 1.27: -63.78,35.77 -63.17,35.77 -40.87,35.77 -33.91,42.73 JP4.5
  pour Top (isolate 0.305, no thermals): -66.29,41.67 -66.88,41.08 -66.88,36.94 -66.52,36.58 -64.02,36.58 -63.68,36.92 -63.68,38.66 -62.32,40.02 -62.32,41.39 -62.6,41.67
  pour Bottom (isolate 0.305, no thermals): -65.54,33.78 -64.66,32.9 -64.66,31.6 -64.17,31.11 -60.63,31.11 -57.93,33.81 -43.6,33.81 -42.97,34.44 -41.48,34.44 -38.35,37.57 -38.35,37.79 -38.54,37.98 -53.44,37.98 -54.93,39.47 -65.18,39.47 -65.54,39.11
BOOST_INP  (via drill 0.35)
  Top 0.305: TP3.TP -54.48,26.6 -52.77,26.6 | -52.77,26.6 -52.29,26.13 | -52.11,26.6 -51.85,26.6 | -51.85,26.6 -51.77,26.6 -51.64,26.72 | -52.11,26.6 -52.29,26.6 | -52.29,26.6 -52.77,26.6 | -51.64,26.72 -47.79,30.58 -47.79,35.69 -41.79,41.69 -20.15,41.69 -17.43,38.97 -13.64,38.97 | -13.64,38.97 -13.57,38.97 | -13.57,38.97 -13.56,38.97 -13.25,38.65 v-13.01,38.65 | U4.2 -6.91,35.75 | -6.91,35.75 -6.91,36.36 v-6.88,36.39 | -52.29,26.6 -52.29,26.13 | -52.29,26.13 -52.15,25.98 | -52.15,25.98 -52.03,25.87 | -52.03,25.87 -51.93,25.77 | -52.11,26.6 -52.11,26.02 -52.15,25.98 | -51.85,26.6 -51.85,26.05 -52.03,25.87 | -51.64,26.72 -51.64,25.88 -51.93,25.6 | -13.57,38.97 -13.18,38.51 v-13.01,38.65 | -13.64,38.97 -12.97,38.86 v-13.01,38.65 | -6.91,35.75 -6.67,36.3 v-6.88,36.39 | -6.91,35.75 -7.09,36.32 v-6.88,36.39
  Top 0.813: R105.1 -51.93,25.6 | -51.93,25.6 -51.93,25.77 | -51.93,25.6 C83.1 -51.94,25.65
  Bottom 0.305: -12.61,38.14 -10.96,36.49 -7.51,36.49 | -12.61,38.14 -13.01,38.54 v-13.01,38.65 | v-6.88,36.39 -6.98,36.49 -7.51,36.49 | -12.61,38.14 -12.79,38.72 v-13.01,38.65 | -12.61,38.14 -13.13,38.46 v-13.01,38.65 | -7.51,36.49 -6.99,36.19 v-6.88,36.39 | -7.51,36.49 -6.92,36.61 v-6.88,36.39
CANHI
  Top 0.305: R74.1 -30.92,16.59 L3.3
  Top 0.813: R72.2 -29.47,11.18 -29.89,11.6 JP1.2 -29.89,15.51 -29.29,16.11 | -29.29,16.11 -26.78,16.11 D12.1 | R74.1 -30.33,16.11 -29.29,16.11
  Bottom 0.61: -31.32,4.86 -30.55,5.63 -30.55,13.12 JP1.2 -29.36,13.25 -29.36,5.28 | -29.36,5.28 -30.86,3.78 | -29.36,5.28 -29.36,4.61 -30.78,3.19
  Bottom 0.813: JP1.2 -29.89,5.49 X5.2
CANL  (via drill 0.35)
  Top 0.406: L3.4 -30.62,18.48 -30.44,18.66 -26.27,18.66 D12.2
  Top 0.61: R75.1 -30.39,7.32 | -30.39,7.32 -28.75,7.32 | -28.75,7.32 -28.21,7.32 | -28.21,7.32 -27.54,7.32 | -27.54,7.32 -26.94,7.32 -25.9,6.28 X5.1 | -30.39,7.32 -30.77,7.32 | -30.77,7.32 -33.07,9.62 -33.07,9.99 -31.89,8.8 R75.1 | R75.1 -32.67,9.61 -32.67,10.38 | -30.77,7.32 -31.03,7.32 | -31.03,7.32 R76.2 | -31.03,7.32 -31.47,7.32 -33.89,9.74 | -27.54,7.32 -26.29,6.07 -26.29,5.4 | -28.21,7.32 -26.29,5.4 | -26.29,4.86 -26.29,5.4 | -28.75,7.32 -26.29,4.86 | -26.29,4.86 -26.29,4.38
  Top 0.813: R76.2 -33.07,9.99 -32.67,10.38 R72.1 -31.88,10.58 | D12.2 -26.2,19.54 v-25.99,19.75
  Top 1: R72.1 R75.1
  Bottom 0.61: -25.86,8.84 -26.54,8.16 -26.54,4.64
  Bottom 0.813: v-25.99,19.75 -25.86,19.75 -25.86,8.84 -25.86,5.69 -25.9,5.65 X5.1
CANRX  (via drill 0.35)
  Top 0.305: -40.94,23.18 -40.94,23.52 | -37.62,23.88 -37.74,24 -40.46,24 -40.94,23.52 | -37.62,23.88 -36.71,22.97 -36.71,22.66 | -36.71,22.66 IC1.3 | -40.94,22.63 R57.1 | R57.1 -41.03,22.83 -41.89,21.97 -42.18,21.97 | -42.18,21.97 -42.4,21.97 | -42.4,21.97 -48.92,21.97 -49.31,22.37 -49.31,27.35 -49.29,27.37 -49.29,27.43 -46.58,30.13 -46.58,35.21 -41.29,40.5 -20.62,40.5 -17.87,37.75 -14.13,37.75 -13.37,36.99 | U4.45 -8.92,31.83 | -8.92,31.83 -9.1,31.83 -9.42,31.51 v-9.48,31.51 | v-12.73,36.98 -13.36,36.98 -13.37,36.99 | R57.1 -40.94,23.17 | -40.94,23.17 -40.94,23.18 | -40.24,23.88 -40.12,24 -39.52,24 | -40.24,23.88 -40.94,23.18 | -40.24,23.88 -37.93,23.88 | -37.93,23.88 -37.62,23.88 | -37.93,23.88 -36.71,22.66 | -42.18,21.97 -40.98,23.17 -40.94,23.17 | -40.94,23.52 -42.4,22.06 -42.4,21.97 | -13.37,36.99 -12.81,36.77 v-12.73,36.98 | -13.37,36.99 -12.8,37.19 v-12.73,36.98 | -8.92,31.83 -9.52,31.73 v-9.48,31.51 | -8.92,31.83 -9.3,31.36 v-9.48,31.51
  Bottom 0.305: -9.22,32.1 -9.22,33.35 -9.97,34.22 -12.28,36.52 | -9.22,32.1 -9.22,31.77 v-9.48,31.51 | v-12.73,36.98 -12.28,36.52 | -12.28,36.52 -12.53,37.07 v-12.73,36.98 | -12.28,36.52 -12.82,36.77 v-12.73,36.98 | -9.22,32.1 -9.64,31.67 v-9.48,31.51 | -9.22,32.1 -9.25,31.5 v-9.48,31.51
CANTX  (via drill 0.35)
  Top 0.305: IC1.2 -35.45,23.2 -36.83,24.58 -40.82,24.58 -42.84,22.56 -48.43,22.56 -48.71,22.83 -48.71,27.18 -46,29.89 -46,34.96 -41.07,39.89 -20.83,39.89 -18.06,37.12 -14.38,37.12 -13.03,35.77 | v-12.86,35.15 -12.86,35.6 -13.03,35.77 | v-10.06,32.59 -9.8,32.33 -9.47,32.33 | U4.46 -9.47,32.33 | -13.03,35.77 -13.09,35.17 v-12.86,35.15 | -13.03,35.77 -12.68,35.28 v-12.86,35.15 | -9.47,32.33 -9.9,32.75 v-10.06,32.59 | -9.47,32.33 -10.07,32.37 v-10.06,32.59
  Bottom 0.305: v-10.06,32.59 -10.06,33.09 -10.19,33.22 | -10.19,33.22 -12.12,35.15 -12.22,35.15 | -12.22,35.15 v-12.86,35.15 | -12.22,35.15 -12.78,35.36 v-12.86,35.15 | -12.22,35.15 -12.78,34.94 v-12.86,35.15 | -10.19,33.22 -10.28,32.62 v-10.06,32.59 | -10.19,33.22 -9.87,32.71 v-10.06,32.59
CBUS_ISO_5V  (via drill 0.35)
  Top 0.305: Q6.7 -25.82,29.54 | C48.1 -28.8,22.46
  Top 0.61: C48.1 -28.61,20 v-29.05,19.55 | -33.47,15.95 IC1.8 -34.17,15.46 | -33.47,15.95 v-33.2,15.95 -32.08,15.95 R74.2 | C46.2 -34.44,14.54 -34.17,14.8 -34.17,15.46 | -34.17,15.46 -33.69,15.95 -33.47,15.95
  Top 0.813: C48.1 -28.06,22.65 -27.01,23.7 -27.01,28.82 -26.3,29.54 Q6.7
  Top 1.016: C45.2 -26.65,33.19 -25.82,32.36 -25.82,29.54
  Bottom 0.305: v-29.05,19.55 -28.73,19.23 -28.73,18.99 | -32.56,15.97 -29.34,15.97 -28.73,16.58 -28.73,18.99 | -32.56,15.97 -33.15,15.97 -33.17,15.95 v-33.2,15.95 | -28.73,18.99 -28.83,19.59 v-29.05,19.55 | -28.73,18.99 -29.19,19.38 v-29.05,19.55 | -32.56,15.97 -33.13,16.16 v-33.2,15.95 | -32.56,15.97 -33.11,15.74 v-33.2,15.95
CBUS_ISO_GND  (via drill 0.35)
  Top 0.305: -36.6,15.43 -36.93,15.43 v-37.19,15.17 | -36.6,15.43 -35.76,15.43 -35.45,15.75 IC1.7 | -37.3,15.06 v-37.19,15.17 | -36.6,15.43 -37.2,15.39 v-37.19,15.17 | -36.6,15.43 -37.03,15.01 v-37.19,15.17
  Top 0.61: C48.2 -30.19,20.14 v-30.92,19.41 | v-37.19,15.17 -37.19,12.97 -37.3,12.86
  Top 0.813: R76.1 C52.2 -36.01,11.56 -37.3,12.86 R77.2 | Q6.5 -30.19,28.86 C48.2
  Bottom 0.305: v-30.92,19.41 -30.92,18.77 | -30.92,18.77 -30.92,18.56 -31.65,17.83 -34.1,17.83 -34.68,17.25 -34.68,15.84 -35.28,15.24 -36.55,15.24 | -36.55,15.24 -37.14,15.24 -37.19,15.19 v-37.19,15.17 | -30.92,18.77 -30.71,19.33 v-30.92,19.41 | -30.92,18.77 -31.13,19.33 v-30.92,19.41 | -36.55,15.24 -37.13,15.39 v-37.19,15.17 | -36.55,15.24 -37.09,14.97 v-37.19,15.17
CUT_OFF_OUTPUT_  (via drill 0.35)
  Top 0.305: U4.13 -14.53,33.33 -16.02,34.81 | -16.02,34.81 -16.26,35.06 v-16.26,35.41 | -16.02,34.81 -16.03,35.42 v-16.26,35.41 | -16.02,34.81 -16.43,35.26 v-16.26,35.41
  Bottom 0.305: v-16.26,35.41 -16.5,35.65 -16.5,36.01 | -32.95,49.66 -18.94,49.66 -16.5,47.21 -16.5,36.01 | -32.95,49.66 -33.29,49.66 | -33.91,48.48 -33.91,49.04 -33.29,49.66 | -33.91,48.48 JP4.6 -34.18,47.47 -34.18,48.45 | -32.95,49.66 -33.71,48.9 -33.71,48.47 | -33.71,48.47 -33.71,47.18 | -33.29,49.66 -33.62,49.66 -34.18,49.1 -34.18,48.45 | -16.5,36.01 -16.49,35.41 v-16.26,35.41 | -16.5,36.01 -16.09,35.56 v-16.26,35.41 | -33.91,48.48 -34.44,47.48 | -33.91,48.48 -33.38,47.48 | -33.71,48.47 -34.39,47.56 | -33.71,48.47 -33.34,47.4 | -34.18,48.45 -34.49,47.36 | -34.18,48.45 -33.45,47.59
GND3  (via drill 0.35)
  Top 0.305: v-34.1,13.28 v-34.1,13.27
  Top 0.61: C46.1 -34.42,12.96 v-34.1,13.28 | D12.3 -28.79,17.25 v-29.77,17.25
  Bottom 0.305: v-34.1,13.28 -34.1,13.92 | -34.1,13.92 -34.1,17.01 -33.86,17.25 -30.41,17.25 | -30.41,17.25 v-29.77,17.25 | -34.1,13.92 -34.31,13.36 v-34.1,13.28 | -34.1,13.92 -33.89,13.36 v-34.1,13.28 | -30.41,17.25 -29.85,17.04 v-29.77,17.25 | -30.41,17.25 -29.85,17.46 v-29.77,17.25
GNDA_  (via drill 0.35)
  Top 0.203: -20.38,7.39 X7.P$2 | -13.6,15.53 -13.6,15.81
  Top 0.254: L4.1 L4.4 -17.01,15.1 -16.85,14.94 | -14.45,14.42 -14.73,14.42 | -14.73,14.42 -14.9,14.42 | -14.9,14.42 -15.32,14.42 | -15.32,14.42 -15.58,14.42 | -15.58,14.42 -16.04,14.42 | -16.04,14.42 -16.33,14.42 | -16.85,14.94 -16.7,14.79 | -16.7,14.79 -16.48,14.57 | -16.48,14.57 -16.33,14.42 | -16.48,14.57 -15.96,14.57 | -15.96,14.57 -15.22,14.57 | -15.22,14.57 -13.95,14.57 -13.6,14.92 | -16.7,14.79 -14.02,14.79 -13.96,14.84 | -13.96,14.84 -13.86,14.94 | -13.86,14.94 -13.6,15.2 | -16.85,14.94 -14.37,14.94 | -14.37,14.94 -13.86,14.94 | -16.33,14.42 -13.77,11.86 -13.6,11.86 | -16.04,14.42 -13.9,12.28 -13.67,12.28 | -15.96,14.57 -13.67,12.28 | -13.67,12.28 -13.6,12.28 | -15.58,14.42 -14.06,12.9 -13.8,12.9 | -15.32,14.42 -13.8,12.9 | -13.8,12.9 -13.6,12.9 -13.6,12.95 -15.22,14.57 | -14.9,14.42 -13.88,13.4 -13.71,13.4 | -14.73,14.42 -13.97,13.66 | -13.97,13.66 -13.71,13.4 | -13.71,13.4 -13.6,13.4 | -14.45,14.42 -13.97,13.94 | -13.97,13.94 -13.97,13.66 | -14.45,14.42 -14.24,14.42 | -14.24,14.42 -13.6,14.42 | -14.24,14.42 -13.97,14.15 -13.97,13.94 | -14.37,14.94 -13.96,15.35 | -13.96,15.35 -13.6,15.71 -13.6,15.81 | -13.96,14.84 -13.96,15.35
  Top 0.305: -13.46,16.51 C93.2 | -20.28,19.92 C102.2 | C101.2 -18.93,19.96 | C100.1 -68.21,29.99 | D19.A1 -66.95,19.64 | v-53.29,22.09 v-53.28,22.08 -53.27,22.07 | v-39.69,22.71 -39.05,22.71 | -39.05,22.71 -38.59,22.71 IC1.4 | -39.12,25.87 -41.31,25.87 -42.34,24.84 -43.78,24.84 C40.1 -44.05,25.11 -42.14,25.11 | -39.12,25.87 -38.57,25.87 -38.48,25.96 v-38.48,25.98 | C99.2 C97.2 -49.76,34.87 C96.2 | C88.2 -4.75,23.87 | -4.75,23.87 -5.55,23.87 -6.91,25.23 U4.35 | -1.74,32.36 -1.73,32.36 C76.2 | -1.72,32.34 -1.74,32.36 | -1.74,32.36 -1.75,32.37 | -3.05,32.11 C77.2 -3.77,32.83 U4.47 | U4.23 -14.32,28.33 -14.62,28.03 -14.62,25.26 | -14.62,24.58 -14.62,25.26 | -15.39,24.58 C82.2 -15.3,24.58 -14.62,25.26 | -20.77,42.6 C38.2 | v-19.49,42.18 v-19.48,42.18 | R67.2 -19.16,32.91 | U4.8 -9.89,34.85 -9.89,39.25 -9.35,39.79 C69.2 | -1.59,39.53 C60.2 | C67.2 -9.46,41.88 | -14.62,25.26 | C81.2 -13.95,24.58 -14.62,25.26 | -4.75,23.87 -4.49,24.13 -4.19,24.13 | -4.75,23.87 -4.47,23.59 -4.02,23.59 | -39.05,22.71 -39.61,22.92 v-39.69,22.71 | -39.05,22.71 -39.61,22.5 v-39.69,22.71 | -39.12,25.87 -38.53,25.76 v-38.48,25.98 | -39.12,25.87 -38.6,26.17 v-38.48,25.98
  Top 0.508: C106.2 -67.96,35.84 | v-19.48,42.18 -19.02,41.73 | -19.02,41.73 -16.96,39.66 -13.87,39.66 | -13.87,39.66 -13.47,39.66 | -13.47,39.66 -13.3,39.66 v-13.23,39.73 | v-9.22,38.72 -9.22,39.36 | -9.22,39.36 -9.22,40.07 C69.2 | -19.02,41.73 -19.38,42.25 v-19.48,42.18 | -19.02,41.73 -19.55,42.08 v-19.48,42.18 | -13.47,39.66 -13.23,39.64 v-13.23,39.73 | -13.87,39.66 -13.26,39.85 v-13.23,39.73 | -9.22,39.36 -9.34,38.74 v-9.22,38.72 | -9.22,39.36 -9.1,38.74 v-9.22,38.72
  Top 0.61: Q9.2 -43.13,13.74 v-43.11,13.76 -43.11,14.84 R87.1 | IC9.1 -55.57,32.22 -55.19,32.6 -51.57,32.6 C109.2 C113.2 -49.68,33.39 C96.2 | U5.4 -63.75,24.86 -64.33,24.28 v-64.9,24.28 | U5.4 -65.02,24.34 -65.27,24.34 | -65.07,23.63 -63.15,25.55 -63.15,25.57 -63.19,25.61 U5.4 | C100.1 -68.57,30.61 v-68.57,31.21 | C107.1 -53.2,20.6 -53.2,22 -53.27,22.07 | D21.1 -53.29,23.73 v-53.29,22.09 | C94.2 -62.02,29.87 v-61.68,29.53 | R138.1 v-59.4,21.18 | TVS1.A -13.46,16.51 | v-18.89,21.24 C101.2 | C89.2 -2.82,23.54 v-2.82,22.61 | C77.2 -2.94,32 | v-2.94,30.91 -2.94,31.46 | -2.94,31.46 -2.94,32 | -2.94,32 -2.11,32 -1.72,31.61 -2.79,31.61 -2.94,31.46 | v-19.22,33.79 -19.22,32.97 R67.2 | C60.2 -1.63,41.18 v-1.59,41.22 C63.2 | C38.2 -19.91,42.61 v-19.48,42.18 | v-19.5,45.46 -19.63,45.59 C42.2 | C82.2 -15.61,24.58 -16.26,23.93 v-18.08,23.93
  Top 0.813: Z4.1 -52.02,18.35 -52.65,18.98 C107.1 | D21.1 -53.57,25.54 C83.2 | C105.2 C106.2 C104.2 v-67.95,40.07 -67.95,42.73 Z7.1 | C99.2 -55.5,34.87 IC7.3 | IC7.3 -54.83,38.82 v-53.31,38.82 -53.29,38.84 v-52.53,38.84 v-51.77,38.84 v-51.76,38.83 -51.76,38.06 v-51.73,38.03 -52.49,38.03 v-52.51,38.01 -53.26,38.01 v-53.28,37.99 | IC7.3 -55.61,38.04 -52.26,38.04 | C41.2 -44.05,25.13 C40.1 C44.1 | R59.2 C42.2 | C93.2 -13.6,15.81 -13.6,15.2 -13.6,14.92 -13.6,14.42 -13.6,13.4 -13.6,12.9 -13.6,12.28 -13.6,11.86 -13.6,8.34 X7.GND | R127.1 -66.26,21.59 | -66.26,21.59 -66.26,20.34 -66.95,19.64 -66.66,19.35 -66.11,19.35 -66.11,20.44 | v-65.07,21.48 -65.68,21.48 | -65.68,21.48 -66.15,21.48 -66.26,21.59 | R127.1 -66.26,23.33 IC6.A -66.91,24.28 -65.97,24.28 | -65.5,24.28 v-64.9,24.28 -65.07,24.11 -65.07,23.63 v-65.07,21.48 | -65.5,24.28 -65.97,24.28 | -65.97,24.28 -66.26,23.99 R127.1 | -65.97,24.28 -65.97,21.77 | -65.97,21.77 -65.68,21.48 | -65.5,24.28 -65.5,22.24 -65.97,21.77 | -65.68,21.48 -66.11,21.05 -66.11,20.44 | v-65.07,21.48 -66.11,20.44 | -66.26,21.59 -67.72,20.13 -67.72,20.01 -67.3,19.59 D19.A1 | C102.2 -20.24,19.96 -18.93,19.96 | C82.2 C81.2 | C88.2 C89.2 | C77.2 C76.2 -1.72,31.61 R94.1 | R67.2 -17.61,32.58 C47.2 | -9.44,43.25 C57.1 -9.36,43.16 C67.2 C69.2 | R53.2 -20.77,42.6 | -17.74,2.02 -18.14,2.42 | -18.14,2.42 -19.56,3.84 -19.56,6.64 | -18.14,2.42 -10.31,2.42 | -10.31,2.42 -9.39,2.42 -8.6,3.21 -8.78,3.39 -8.78,3.95 | -8.78,3.95 -8.78,6.83 | -8.78,3.95 -10.31,2.42 | X7.P$3 -7.51,6.56 -7.51,3.09 -8.58,2.02 | -8.58,2.02 -13.66,2.02 | -8.58,2.02 -9.1,1.5 -18.28,1.5 | -19.69,2.91 -18.28,1.5 | -18.28,1.5 -19.39,1.5 -20.83,2.94 -20.83,6.94 -20.38,7.39
  Top 1.016: X7.P$2 -20.27,3.49 -19.69,2.91 -18.8,2.02 -17.74,2.02 -13.66,2.02 -9.79,2.02 -8.6,3.21 -8.23,3.58 X7.P$3
  Bottom 0.305: -65.26,21.48 -65.13,21.48 v-65.07,21.48 | v-59.4,21.18 -60.04,21.18 | -60.04,21.18 -64.5,21.18 | -64.5,21.18 -64.77,21.18 v-65.07,21.48 | v-61.68,29.53 -62.32,29.53 | -62.32,29.53 -64.41,29.53 -64.87,29.07 -64.87,24.92 | v-64.9,24.28 -64.87,24.31 -64.87,24.92 | v-59.4,21.18 -58.76,21.18 | -58.76,21.18 -53.72,21.18 -53.44,21.46 | v-53.28,22.08 -53.25,22.05 -53.25,21.65 -53.44,21.46 | -2.71,22.5 v-2.82,22.61 | v-2.94,30.91 -2.82,30.79 -2.82,30.28 | -2.82,30.28 -2.82,23.26 | -2.82,23.26 v-2.82,22.61 | -18.89,23.86 -18.82,23.93 -18.72,23.93 | -18.72,23.93 v-18.08,23.93 | -19.5,42.2 v-19.48,42.18 | v-2.94,30.91 -2.3,30.91 | -2.3,30.91 -2.11,30.91 -1.59,31.43 -1.59,40.58 | -1.59,40.58 v-1.59,41.22 | -64.5,21.18 -64.9,21.63 v-65.07,21.48 | -64.5,21.18 -65.1,21.26 v-65.07,21.48 | -60.04,21.18 -59.48,20.96 v-59.4,21.18 | -60.04,21.18 -59.48,21.39 v-59.4,21.18 | -58.76,21.18 -59.32,21.39 v-59.4,21.18 | -58.76,21.18 -59.32,20.96 v-59.4,21.18 | -62.32,29.53 -61.76,29.32 v-61.68,29.53 | -62.32,29.53 -61.76,29.74 v-61.68,29.53 | -64.87,24.92 -65.11,24.37 v-64.9,24.28 | -64.87,24.92 -64.69,24.35 v-64.9,24.28 | -53.44,21.46 -53.09,21.95 v-53.28,22.08 | -53.44,21.46 -53.51,22.06 v-53.28,22.08 | -2.82,23.26 -3.03,22.69 v-2.82,22.61 | -2.82,23.26 -2.61,22.69 v-2.82,22.61 | -2.82,30.28 -2.72,30.87 v-2.94,30.91 | -2.82,30.28 -3.13,30.79 v-2.94,30.91 | -2.3,30.91 -2.86,31.12 v-2.94,30.91 | -2.3,30.91 -2.86,30.7 v-2.94,30.91 | -18.72,23.93 -18.16,23.72 v-18.08,23.93 | -18.72,23.93 -18.16,24.14 v-18.08,23.93 | -1.59,40.58 -1.38,41.14 v-1.59,41.22 | -1.59,40.58 -1.8,41.14 v-1.59,41.22
  Bottom 0.508: v-13.23,39.73 -12.58,39.73 | -12.58,39.73 -9.67,39.73 -9.3,39.36 | -9.3,39.36 -9.23,39.29 v-9.23,38.73 v-9.22,38.72 | v-13.23,39.73 -13.53,40.03 -13.53,40.3 | -15.37,49.16 -14.58,48.37 -14.58,45.57 -13.53,44.52 -13.53,40.3 | -15.37,49.16 -15.85,49.64 PROG1.3 | -12.58,39.73 -13.2,39.85 v-13.23,39.73 | -12.58,39.73 -13.2,39.61 v-13.23,39.73 | -13.53,40.3 -13.35,39.7 v-13.23,39.73 | -13.53,40.3 -13.13,39.81 v-13.23,39.73 | -9.3,39.36 -9.34,38.73 v-9.22,38.72 | -9.3,39.36 -9.1,38.76 v-9.22,38.72 | -15.37,49.16 -15.74,49.67 PROG1.3 | -15.37,49.16 -15.91,49.49 PROG1.3
  Bottom 0.61: X2.3 -55.3,11.93 -53.47,13.76 | v-43.11,13.76 -53.47,13.76 | -53.47,13.76 -53.4,13.83 -62.56,13.83 -63.42,14.69 -63.42,19.77 -65.13,21.48 | -19.22,25.44 v-19.22,33.79 -19.22,41.92 v-19.48,42.18 | -19.22,25.44 -19.22,25.07 v-18.08,23.93 | -19.22,25.44 -19.75,24.91 -19.94,24.91 | v-2.82,22.61 -2.82,20.2 -3.75,19.27 -6.99,19.27 | -6.99,19.27 -7.71,19.27 | -7.71,19.27 -8.75,19.27 | -9.12,19.27 -18.47,19.27 -18.89,19.69 v-18.89,21.24 | X7.P$3 -8.23,10.18 | -8.23,10.18 -8.23,18.02 | -8.23,18.02 -8.23,18.38 | -8.23,18.38 -8.23,18.75 | -8.23,18.75 -7.71,19.27 | -8.23,18.02 -6.99,19.26 -6.99,19.27 | -8.23,18.75 -8.75,19.27 | -8.75,19.27 -9.12,19.27 | -8.23,18.38 -9.12,19.27 | -8.23,10.18 -9.46,7.96 | -8.23,10.18 -7,7.96
  Bottom 0.813: v-53.31,38.82 -54.57,40.08 | -54.57,40.08 v-67.94,40.08 v-67.95,40.07 -68.57,39.45 v-68.57,31.21 -68.57,22.88 -67.17,21.48 -65.26,21.48 | -54.57,40.08 -53.56,40.08 | -53.56,40.08 -52.53,39.05 v-52.53,38.84 -52.51,38.82 v-52.51,38.01 | v-53.31,38.82 | v-53.31,38.82 -53.31,38.02 | -53.56,40.08 -53.01,40.08 | -53.01,40.08 -52.52,39.59 v-51.76,38.83 -51.76,38.01 -51.75,38 | v-43.11,13.76 -43.11,21.89 -42.29,22.71 v-39.69,22.71 | -38.48,24.91 v-38.48,25.98 Q6.2 | -38.48,24.91 -38.48,23.92 v-39.69,22.71 | -38.48,24.91 -37.49,24.91 | -36.57,24.91 -21.33,24.91 | -21.33,24.91 -19.94,24.91 -18.89,23.86 -18.89,23.52 | -18.89,23.52 v-18.89,21.24 -19.43,21.79 -19.43,24.07 | v-39.69,22.71 -37.49,24.91 | -37.49,24.91 -36.57,24.91 | v-39.69,22.71 -38.77,22.71 -37.08,24.4 | -37.08,24.4 -36.57,24.91 | -37.08,24.4 -21.84,24.4 | -21.33,24.91 -21.84,24.4 | -21.84,24.4 -19.77,24.4 -19.43,24.07 | -19.43,24.07 -18.89,23.52 | -53.01,40.08 -41.84,40.08
  Bottom 1.016: X7.GND -8.69,7.74 X7.P$3
  Bottom 1.27: -37.62,44.66 JP4.3 -36.45,42.38 -37.24,41.59 | -37.62,44.66 JP4.1 | -52.51,38.82 -40.01,38.82 -39.24,39.59 | -52.52,39.59 -39.24,39.59 | -39.24,39.59 -38.75,40.08 | -37.24,41.59 -38,40.83 | -38,40.83 -38.75,40.08 | -38.75,40.08 -39.59,40.08 | -39.59,40.08 -40.96,40.08 | -40.96,40.08 -41.84,40.08 -38.99,42.93 | -37.62,44.66 -37.24,44.28 -37.24,41.59 | JP4.1 -38,43.67 -38,40.83 | JP4.1 -38.99,42.93 | -38.99,42.93 -38.99,42.05 | -38.99,42.05 -38.99,40.68 -39.59,40.08 | -38.99,42.05 -40.96,40.08
  other vias: -15.84,49.6
  pour Top (isolate 0.305, no thermals): -61.25,33.72 -60.98,33.45 -57.82,33.45 -57.23,32.86 -57.23,32.24 -56.91,31.92 -55.79,31.92 -54.93,32.78 -49.26,32.78 -49.01,33.03 -49.01,35.15 -49.18,35.32 -53.8,35.32 -54.05,35.57 -54.05,37.13 -53.62,37.56 -51.55,37.56 -51.31,37.8 -51.31,39.42 -51.52,39.63 -61.05,39.63 -61.25,39.43
  pour Bottom (isolate 0.406, rank 2, no thermals): -68.92,49.92 -67.99,50.85 -1.46,50.85 -0.9,50.29 -0.9,1.96 -1.41,1.45 -19.15,1.45 -20.52,2.82 -20.52,20.22 -24.41,24.11 -38.11,24.11 -41.08,21.14 -41.08,2.28 -41.68,1.68 -68.19,1.68 -68.88,2.37 -68.88,22.79 -68.92,22.83
GNDIO_
  Top 0.813: JP4.11 -25.39,45.56 R58.1
I_OUT_ADC_  (via drill 0.35)
  Top 0.305: U4.18 -14.71,30.83 -14.84,30.96 | v-15.15,31.52 -15.15,31.27 -14.84,30.96 | -14.84,30.96 -14.93,31.55 v-15.15,31.52 | -14.84,30.96 -15.3,31.35 v-15.15,31.52
  Bottom 0.305: v-15.15,31.52 -15.77,31.52 | -15.77,31.52 -15.8,31.52 | -15.8,31.52 -17.2,31.52 -17.69,32.01 -17.69,46.76 -19.42,48.49 -27.26,48.49 | JP4.10 -28.83,47.8 -28.27,48.35 | -27.26,48.49 -27.53,48.49 | -27.53,48.49 -27.83,48.49 | -27.83,48.49 -28.14,48.49 | -28.14,48.49 -28.27,48.35 | -28.14,48.49 -28.52,48.49 -28.56,48.45 | -29.13,47.28 -29.13,47.88 -28.56,48.45 | -27.83,48.49 -28.08,48.24 | -28.08,48.24 -28.83,47.49 JP4.10 | -27.53,48.49 -27.92,48.1 | -27.92,48.1 JP4.10 | JP4.10 | -27.26,48.49 -27.8,47.95 | -27.8,47.95 -28.55,47.2 JP4.10 | -15.77,31.52 -15.23,31.32 v-15.15,31.52 | -15.8,31.52 -15.23,31.73 v-15.15,31.52 | -28.27,48.35 -29.19,47.69 | -28.27,48.35 -28.23,47.22 | -28.56,48.45 -29.29,47.59 | -28.56,48.45 -28.25,47.36 | -28.08,48.24 -29.1,47.74 | -28.08,48.24 -28.23,47.12 | -27.92,48.1 -29,47.78 | -27.92,48.1 -28.26,47.02 | -27.8,47.95 -28.91,47.8 | -27.8,47.95 -28.29,46.94
I_PWM_  (via drill 0.35)
  Top 0.305: v-10.54,31.39 -10.6,31.33 -11.15,31.33 | -11.15,31.33 -11.19,31.33 | -11.19,31.33 U4.17 | -11.19,31.33 -10.61,31.17 v-10.54,31.39 | -11.15,31.33 -10.64,31.58 v-10.54,31.39
  Bottom 0.305: v-10.54,31.39 -10.58,31.42 -11.08,31.42 | -11.08,31.42 -11.19,31.42 | -11.19,31.42 -13.84,31.42 -15.44,33.02 -15.44,35.76 -15.88,36.2 -15.88,47.43 -18.7,50.24 -35.23,50.24 | -36.45,49.48 -36.45,49.24 | -36.45,49.24 -36.45,48.48 | -36.45,48.48 JP4.4 | -35.23,50.24 -35.45,50.24 | -35.45,50.24 -35.69,50.24 -36.45,49.48 | -36.45,49.48 -36.68,49.25 -36.68,48.46 | -36.68,48.46 -36.68,47.1 | -35.45,50.24 -36.17,49.53 | -36.17,49.53 -36.33,49.37 | -36.33,49.37 -36.45,49.24 | -36.33,49.37 -36.33,49.02 | -36.33,49.02 -36.33,48.48 | -36.33,48.48 -36.33,47.32 JP4.4 | -36.17,49.53 -36.17,49.31 | -36.17,49.31 -36.17,48.45 | -36.17,48.45 -36.17,47.48 JP4.4 | -36.17,49.31 -35.23,50.24 | -36.33,49.02 -35.1,50.24 -34.83,50.24 | -11.19,31.42 -10.63,31.18 v-10.54,31.39 | -11.08,31.42 -10.6,31.57 v-10.54,31.39 | -36.45,48.48 -36.98,47.48 | -36.45,48.48 -35.92,47.48 | -36.68,48.46 -37.02,47.38 | -36.68,48.46 -35.98,47.57 | -36.33,48.48 -36.95,47.53 | -36.33,48.48 -35.89,47.43 | -36.17,48.45 -36.91,47.59 | -36.17,48.45 -35.87,47.36
JTDO  (via drill 0.35)
  Top 0.305: U4.39 -6.56,28.83 -6.66,28.93 | v-7.08,29.42 -7.08,29.35 -6.66,28.93 | -6.66,28.93 -6.87,29.5 v-7.08,29.42 | -6.66,28.93 -7.19,29.22 v-7.08,29.42
  Top 0.61: v-8.89,45.96 -8.22,46.63 PROG1.6
  Bottom 0.305: v-7.08,29.42 -6.44,29.42 | -6.44,29.42 -6.19,29.42 -5.85,29.76 -5.85,44.27 -7.58,46 -8.25,46 | v-8.89,45.96 -8.85,46 -8.25,46 | -6.44,29.42 -7,29.63 v-7.08,29.42 | -6.44,29.42 -7,29.21 v-7.08,29.42 | -8.25,46 -8.82,46.18 v-8.89,45.96 | -8.25,46 -8.8,45.76 v-8.89,45.96
LED_B
  Top 0.305: R73.1 -4.49,13.28 -4.79,13.59 | -4.79,13.59 -7.63,16.42 -7.63,20.95 -8.74,22.06 -10.05,22.06 -11.41,23.42 U4.26 | -4.79,13.59 -4.79,12.69 -4.81,12.68
LED_G
  Top 0.305: R79.1 -6.08,13.79 -6.28,14 | -6.28,14 -6.54,14.26 | -6.54,14.26 -8.21,15.93 -8.21,20.71 -8.98,21.48 -10.33,21.48 -11.91,23.06 U4.25 | -6.28,14 -6.28,12.8 -6.32,12.76 -6.54,12.98 -6.54,14.26
LED_R
  Top 0.305: U4.27 -10.91,23.78 -9.78,22.65 -8.5,22.65 -8.46,22.62 -8.44,22.62 -7.04,21.22 -7.04,16.99 -4.13,14.08 | R71.1 -2.91,12.86 -4.13,14.08 | -4.13,14.08 -3.78,14.08 | -3.78,14.08 -2.78,13.08 | -3.78,14.08 -3.52,14.08 -2.51,13.07
N$1
  Top 0.305: L4.6 -19.7,15.72 -20.17,16.19 | -20.17,16.19 R129.1 -20.17,16.55 -19.34,15.72 -18.88,15.72 | -20.17,16.19 -20.54,16.56 -20.54,16.83
N$2
  Route3 0: 0,0 0,52 -70,52 -70,0 0,0
N$3
  cutout Bottom (isolate 0.305, no thermals): -27.41,37.26 -21.53,31.38 -21.53,25.27 -21.64,25.16 -34.52,25.16 -34.85,25.49 -34.85,34.9 -32.49,37.26
N$7  (via drill 0.35)
  Top 0.61: v-2.67,7.45 -2.67,10.99 R71.2
  Bottom 0.305: LED2.1 -2.67,6.46
  Bottom 0.61: -2.67,6.46 v-2.67,7.45
N$10
  Top 0.813: R109.2 -48.09,20.55 Z4.3 -50,21.69 R107.2 -50.35,22.04 R105.2
N$14
  Top 0.813: R109.1 -45.89,18.44 D15.A
N$33  (via drill 0.35)
  Top 0.813: D15.C -41.86,18.93 v-41.86,20.17
  Bottom 0.813: X2.1 -45.14,9.86 -41.85,13.15 | -41.85,13.15 v-41.85,20.16 v-41.86,20.17 | -41.85,13.15 -41.85,12.35 | -41.85,12.35 -44.23,9.97 | -44.23,9.97 -44.55,9.65 | -44.55,9.65 -44.94,9.26 | -44.55,9.65 -44.55,4.99 X2.1 | -44.23,9.97 -44.23,9.35 | -44.23,9.35 -44.23,5.32 X2.1 | -44.23,9.35 -41.85,11.72 -41.85,12.35
N$42
  Top 0.813: R127.2 -68.25,22.86 -68.25,26.29 IC6.R -67.94,26.6 R126.1
N$44
  Top 0.61: X2.2 -50.22,6.16 -51.83,7.77 -51.83,16.28 -54.03,18.48 R134.1
  pour Top (isolate 0.305, no thermals): -51.6,6.22 -53.38,8 -53.38,16.58 -54.61,17.81 -58.42,17.81 -58.87,18.26 -58.87,18.51 -58.59,18.79 -53.88,18.79 -51.12,16.03 -51.12,10.27 -49.01,8.16 -49.01,2.84 -49.67,2.18 -51.04,2.18 -51.6,2.74
N$66
  Top 0.305: U4.21 -17.33,29.33 | -17.33,29.33 -17.53,29.33 -17.83,29.03 | TP1.TP -18.01,25.94 -18.01,28.85 -17.83,29.03 | -17.83,29.03 -17.83,28.83 | -17.83,28.83 -17.83,25.9 -17.69,25.76 | -17.83,28.83 -17.33,29.33
N$67